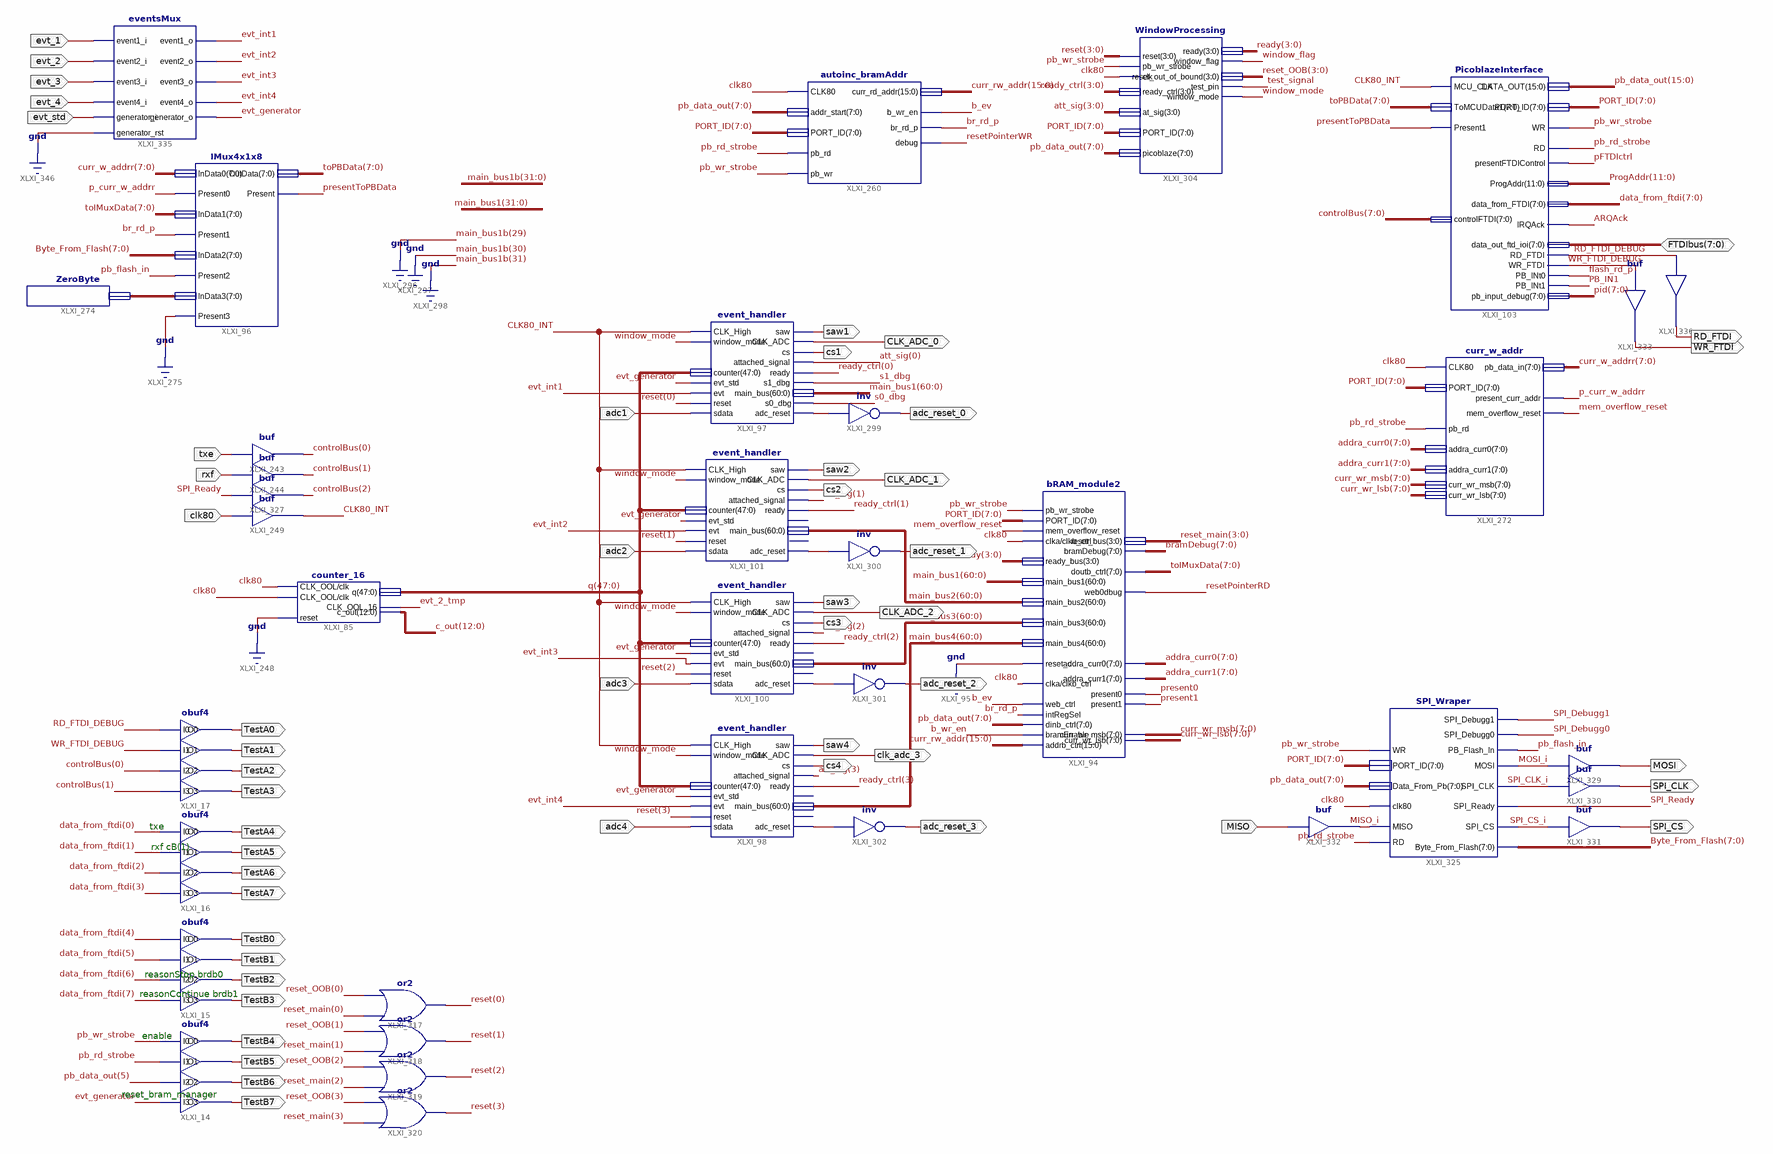
[diagram p0: schematic sheet 1]
// Xilinx ISE schematic MaiModule.sch (spartan6) as structural Verilog: 36 symbols, 51 ports
module MaiModule (
  input  clk80,
  input  adc1,
  input  adc2,
  input  adc3,
  input  adc4,
  input  MISO,
  input  rxf,
  input  txe,
  input  evt_1,
  input  evt_2,
  input  evt_3,
  input  evt_4,
  input  evt_std,
  inout  [7:0] FTDIbus,
  output TestA0,
  output TestA1,
  output TestA2,
  output TestA3,
  output TestA4,
  output TestA5,
  output TestA6,
  output TestA7,
  output TestB0,
  output TestB1,
  output TestB3,
  output TestB4,
  output TestB2,
  output TestB6,
  output TestB7,
  output TestB5,
  output WR_FTDI,
  output cs1,
  output cs2,
  output cs3,
  output cs4,
  output saw4,
  output saw3,
  output saw2,
  output saw1,
  output adc_reset_3,
  output adc_reset_2,
  output CLK_ADC_0,
  output CLK_ADC_1,
  output CLK_ADC_2,
  output clk_adc_3,
  output adc_reset_1,
  output adc_reset_0,
  output SPI_CLK,
  output SPI_CS,
  output MOSI,
  output RD_FTDI
);

  wire ARQAck, b_ev, b_wr_en, br_rd_p, CLK80_INT, evt_2_tmp, evt_generator, evt_int1, evt_int2, evt_int3,
       evt_int4, flash_rd_p, mem_overflow_reset, MISO_i, MOSI_i, p_curr_w_addrr, pb_flash_in, PB_IN1,
       pb_rd_strobe, pb_wr_strobe, pFTDIctrl, present0, present1, presentToPBData, RD_FTDI_DEBUG,
       resetPointerRD, resetPointerWR, s0_dbg, s1_dbg, SPI_CLK_i, SPI_CS_i, SPI_Debugg0, SPI_Debugg1,
       SPI_Ready, test_signal, window_flag, window_mode, WR_FTDI_DEBUG, XLXN_500, XLXN_501, XLXN_502,
       XLXN_503;
  wire [3:0] att_sig, ready, ready_ctrl, reset, reset_main, reset_OOB;
  wire [7:0] addra_curr0, addra_curr1, bramDebug, Byte_From_Flash, controlBus, curr_w_addrr, curr_wr_lsb,
       curr_wr_msb, data_from_ftdi, pid, PORT_ID, toIMuxData, toPBData, XLXN_478;
  wire [11:0] ProgAddr;
  wire [12:0] c_out;
  wire [15:0] curr_rw_addr, pb_data_out;
  wire [47:0] q;
  wire [60:0] main_bus1, main_bus2, main_bus3, main_bus4;

  obuf4 XLXI_14 (
    .I0(pb_wr_strobe), .I1(pb_rd_strobe), .I2(pb_data_out[5]), .I3(evt_generator), .O0(TestB4), .O1(TestB5),
    .O2(TestB6), .O3(TestB7));
  obuf4 XLXI_15 (
    .I0(data_from_ftdi[4]), .I1(data_from_ftdi[5]), .I2(data_from_ftdi[6]), .I3(data_from_ftdi[7]),
    .O0(TestB0), .O1(TestB1), .O2(TestB2), .O3(TestB3));
  obuf4 XLXI_16 (
    .I0(data_from_ftdi[0]), .I1(data_from_ftdi[1]), .I2(data_from_ftdi[2]), .I3(data_from_ftdi[3]),
    .O0(TestA4), .O1(TestA5), .O2(TestA6), .O3(TestA7));
  obuf4 XLXI_17 (
    .I0(RD_FTDI_DEBUG), .I1(WR_FTDI_DEBUG), .I2(controlBus[0]), .I3(controlBus[1]), .O0(TestA0), .O1(TestA1),
    .O2(TestA2), .O3(TestA3));
  PicoblazeInterface XLXI_103 (
    .MCU_CLK(CLK80_INT), .ToMCUData1(toPBData), .Present1(presentToPBData), .DATA_OUT(pb_data_out),
    .PORT_ID(PORT_ID), .WR(pb_wr_strobe), .RD(pb_rd_strobe), .controlFTDI(controlBus), .ProgAddr(ProgAddr),
    .IRQAck(ARQAck), .data_out_ftd_ioi(FTDIbus), .RD_FTDI(RD_FTDI_DEBUG), .WR_FTDI(WR_FTDI_DEBUG),
    .data_from_FTDI(data_from_ftdi), .presentFTDIControl(pFTDIctrl), .PB_INt0(flash_rd_p), .PB_INt1(PB_IN1),
    .pb_input_debug(pid));
  autoinc_bramAddr XLXI_260 (
    .CLK80(clk80), .addr_start(pb_data_out[7:0]), .PORT_ID(PORT_ID), .pb_rd(pb_rd_strobe),
    .pb_wr(pb_wr_strobe), .curr_rd_addr(curr_rw_addr), .b_wr_en(b_ev), .br_rd_p(br_rd_p),
    .debug(resetPointerWR));
  event_handler XLXI_97 (
    .cs(cs1), .ready(ready_ctrl[0]), .main_bus(main_bus1), .saw(saw1), .sdata(adc1), .counter(q),
    .evt(evt_int1), .CLK_High(CLK80_INT), .reset(reset[0]), .evt_std(evt_generator), .adc_reset(XLXN_503),
    .CLK_ADC(CLK_ADC_0), .attached_signal(att_sig[0]), .s0_dbg(s0_dbg), .s1_dbg(s1_dbg),
    .window_mode(window_mode));
  event_handler XLXI_98 (
    .cs(cs4), .ready(ready_ctrl[3]), .main_bus(main_bus4), .saw(saw4), .sdata(adc4), .counter(q),
    .evt(evt_int4), .CLK_High(CLK80_INT), .reset(reset[3]), .evt_std(evt_generator), .adc_reset(XLXN_500),
    .CLK_ADC(clk_adc_3), .attached_signal(att_sig[3]), .window_mode(window_mode));  // open: s0_dbg, s1_dbg
  event_handler XLXI_100 (
    .cs(cs3), .ready(ready_ctrl[2]), .main_bus(main_bus3), .saw(saw3), .sdata(adc3), .counter(q),
    .evt(evt_int3), .CLK_High(CLK80_INT), .reset(reset[2]), .evt_std(evt_generator), .adc_reset(XLXN_501),
    .CLK_ADC(CLK_ADC_2), .attached_signal(att_sig[2]), .window_mode(window_mode));  // open: s0_dbg, s1_dbg
  bRAM_module2 XLXI_94 (
    .clka(clk80), .ready_bus(ready), .main_bus1(main_bus1), .main_bus2(main_bus2), .main_bus3(main_bus3),
    .main_bus4(main_bus4), .reset_c(1'b0), .reset_bus(reset_main), .clkb_ctrl(clk80), .web_ctrl(b_ev),
    .dinb_ctrl(pb_data_out[7:0]), .addrb_ctrl(curr_rw_addr), .doutb_ctrl(toIMuxData),
    .addra_curr0(addra_curr0), .addra_curr1(addra_curr1), .present0(present0), .present1(present1),
    .intRegSel(br_rd_p), .bramEnable(b_wr_en), .web0dbug(resetPointerRD), .curr_wr_lsb(curr_wr_lsb),
    .curr_wr_msb(curr_wr_msb), .mem_overflow_reset(mem_overflow_reset), .PORT_ID(PORT_ID),
    .pb_wr_strobe(pb_wr_strobe), .bramDebug(bramDebug));
  event_handler XLXI_101 (
    .cs(cs2), .ready(ready_ctrl[1]), .main_bus(main_bus2), .saw(saw2), .sdata(adc2), .counter(q),
    .evt(evt_int2), .CLK_High(CLK80_INT), .reset(reset[1]), .evt_std(evt_generator), .adc_reset(XLXN_502),
    .CLK_ADC(CLK_ADC_1), .attached_signal(att_sig[1]), .window_mode(window_mode));  // open: s0_dbg, s1_dbg
  counter_16 XLXI_85 (.q(q), .reset(1'b0), .CLK_OOL_16(evt_2_tmp), .CLK_OOL(clk80), .clk(clk80), .c_out(c_out));
  curr_w_addr XLXI_272 (
    .addra_curr0(addra_curr0), .addra_curr1(addra_curr1), .CLK80(clk80), .pb_data_in(curr_w_addrr),
    .pb_rd(pb_rd_strobe), .PORT_ID(PORT_ID), .curr_wr_msb(curr_wr_msb), .curr_wr_lsb(curr_wr_lsb),
    .present_curr_addr(p_curr_w_addrr), .mem_overflow_reset(mem_overflow_reset));
  not XLXI_299 (adc_reset_0, XLXN_503);
  not XLXI_300 (adc_reset_1, XLXN_502);
  not XLXI_301 (adc_reset_2, XLXN_501);
  not XLXI_302 (adc_reset_3, XLXN_500);
  WindowProcessing XLXI_304 (
    .ready_ctrl(ready_ctrl), .at_sig(att_sig), .PORT_ID(PORT_ID), .picoblaze(pb_data_out[7:0]),
    .ready(ready), .clk(clk80), .pb_wr_strobe(pb_wr_strobe), .window_flag(window_flag), .reset(reset),
    .reset_out_of_bound(reset_OOB), .test_pin(test_signal), .window_mode(window_mode));
  or XLXI_317 (reset[0], reset_main[0], reset_OOB[0]);
  or XLXI_318 (reset[1], reset_main[1], reset_OOB[1]);
  or XLXI_319 (reset[2], reset_main[2], reset_OOB[2]);
  or XLXI_320 (reset[3], reset_main[3], reset_OOB[3]);
  buf XLXI_249 (CLK80_INT, clk80);
  SPI_Wraper XLXI_325 (
    .PORT_ID(PORT_ID), .Data_From_Pb(pb_data_out[7:0]), .clk80(clk80), .MISO(MISO_i), .MOSI(MOSI_i),
    .SPI_CLK(SPI_CLK_i), .SPI_Ready(SPI_Ready), .SPI_CS(SPI_CS_i), .Byte_From_Flash(Byte_From_Flash),
    .RD(pb_rd_strobe), .WR(pb_wr_strobe), .PB_Flash_In(pb_flash_in), .SPI_Debugg0(SPI_Debugg0),
    .SPI_Debugg1(SPI_Debugg1));
  buf XLXI_329 (MOSI, MOSI_i);
  buf XLXI_330 (SPI_CLK, SPI_CLK_i);
  buf XLXI_331 (SPI_CS, SPI_CS_i);
  buf XLXI_332 (MISO_i, MISO);
  buf XLXI_333 (WR_FTDI, WR_FTDI_DEBUG);
  buf XLXI_243 (controlBus[0], txe);
  buf XLXI_244 (controlBus[1], rxf);
  buf XLXI_327 (controlBus[2], SPI_Ready);
  buf XLXI_336 (RD_FTDI, RD_FTDI_DEBUG);
  IMux4x1x8 XLXI_96 (
    .InData0(curr_w_addrr), .InData1(toIMuxData), .InData2(Byte_From_Flash), .InData3(XLXN_478),
    .Present3(1'b0), .Present2(pb_flash_in), .Present1(br_rd_p), .Present0(p_curr_w_addrr),
    .OutData(toPBData), .Present(presentToPBData));
  ZeroByte XLXI_274 (.ZeroData(XLXN_478));
  eventsMux XLXI_335 (
    .event1_i(evt_1), .event2_i(evt_2), .event3_i(evt_3), .event4_i(evt_4), .event1_o(evt_int1),
    .event2_o(evt_int2), .event3_o(evt_int3), .event4_o(evt_int4), .generator_i(evt_std),
    .generator_o(evt_generator), .generator_rst(1'b0));

  // Notes on the sheet:
  //   txe
  //   rxf cB(1)
  //   reasonStop brdb0
  //   reasonContinue brdb1
  //   enable
  //   reset_bram_manager
endmodule
